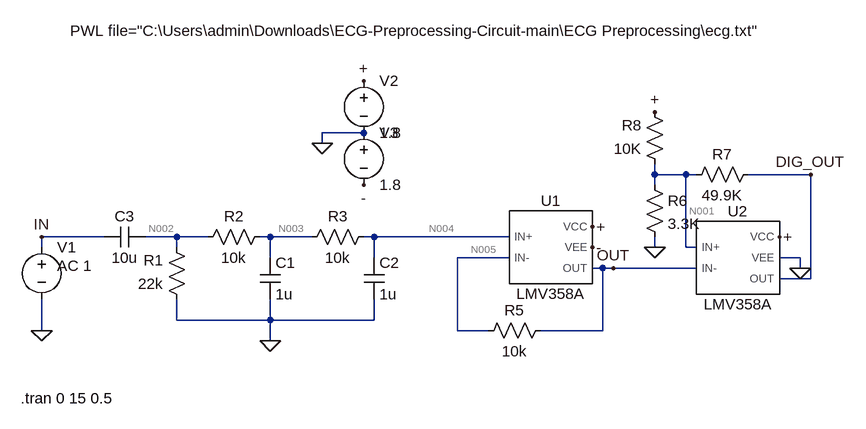
[diagram p0: schematic 心率检测_滞回比较.asc]
心率检测_滞回比较.asc, the LTspice schematic file:
Version 4.1
SHEET 1 1144 680
WIRE 384 -32 320 -32
WIRE 320 -16 320 -32
WIRE 832 32 832 16
WIRE 880 32 832 32
WIRE 896 32 880 32
WIRE 1072 32 976 32
WIRE 832 48 832 32
WIRE -16 128 -112 128
WIRE 96 128 48 128
WIRE 144 128 96 128
WIRE 240 128 224 128
WIRE 304 128 240 128
WIRE 400 128 384 128
WIRE 608 128 400 128
WIRE -112 144 -112 128
WIRE 96 144 96 128
WIRE 832 144 832 128
WIRE 880 144 880 32
WIRE 896 144 880 144
WIRE 240 160 240 128
WIRE 400 160 400 128
WIRE 608 160 528 160
WIRE 1056 160 1024 160
WIRE 752 176 736 176
WIRE 768 176 752 176
WIRE 896 176 768 176
WIRE 1056 176 1056 160
WIRE 1072 192 1072 32
WIRE 1072 192 1024 192
WIRE 96 256 96 224
WIRE 240 256 240 224
WIRE 240 256 96 256
WIRE 400 256 400 224
WIRE 400 256 240 256
WIRE -112 272 -112 224
WIRE 528 272 528 160
WIRE 576 272 528 272
WIRE 752 272 752 176
WIRE 752 272 656 272
WIRE 240 288 240 256
FLAG 240 288 0
FLAG -112 272 0
FLAG 320 -16 0
FLAG 384 48 -
FLAG 384 -112 +
FLAG 736 112 +
FLAG 1024 128 +
FLAG 736 144 -
FLAG 832 144 0
FLAG 832 -64 +
FLAG 1056 176 0
FLAG -112 128 IN
FLAG 768 176 OUT
FLAG 1072 32 DIG_OUT
DATAFLAG 832 32 ""
SYMBOL res 112 240 R180
WINDOW 0 36 76 Left 2
WINDOW 3 36 40 Left 2
SYMATTR InstName R1
SYMATTR Value 22k
SYMBOL res 128 144 R270
WINDOW 0 32 56 VTop 2
WINDOW 3 0 56 VBottom 2
SYMATTR InstName R2
SYMATTR Value 10k
SYMBOL res 288 144 R270
WINDOW 0 32 56 VTop 2
WINDOW 3 0 56 VBottom 2
SYMATTR InstName R3
SYMATTR Value 10k
SYMBOL cap 224 160 R0
SYMATTR InstName C1
SYMATTR Value 1u
SYMBOL cap 384 160 R0
SYMATTR InstName C2
SYMATTR Value 1u
SYMBOL cap 48 112 R90
WINDOW 0 0 32 VBottom 2
WINDOW 3 32 32 VTop 2
SYMATTR InstName C3
SYMATTR Value 10u
SYMBOL voltage -112 128 R0
WINDOW 3 44 -317 Left 2
WINDOW 123 24 44 Left 2
WINDOW 39 0 0 Left 0
SYMATTR Value PWL file="C:\Users\admin\Downloads\ECG-Preprocessing-Circuit-main\ECG Preprocessing\ecg.txt"
SYMATTR Value2 AC 1
SYMATTR InstName V1
SYMBOL LMV358A 672 144 R0
SYMATTR InstName U1
SYMBOL LMV358A 960 160 R0
SYMATTR InstName U2
SYMBOL res 672 256 R90
WINDOW 0 0 56 VBottom 2
WINDOW 3 32 56 VTop 2
SYMATTR InstName R5
SYMATTR Value 10k
SYMBOL res 816 32 R0
SYMATTR InstName R6
SYMATTR Value 3.3K
SYMBOL res 992 16 R90
WINDOW 0 0 56 VBottom 2
WINDOW 3 32 56 VTop 2
SYMATTR InstName R7
SYMATTR Value 49.9K
SYMBOL res 848 32 R180
WINDOW 0 36 76 Left 2
WINDOW 3 36 40 Left 2
SYMATTR InstName R8
SYMATTR Value 10K
SYMBOL voltage 384 -128 R0
WINDOW 123 0 0 Left 0
WINDOW 39 0 0 Left 0
SYMATTR InstName V2
SYMATTR Value 1.8
SYMBOL voltage 384 -48 R0
WINDOW 123 0 0 Left 0
WINDOW 39 0 0 Left 0
SYMATTR InstName V3
SYMATTR Value 1.8
TEXT -144 376 Left 2 !.tran 0 15 0.5

The netlist it stands for:
* 心率检测_滞回比较.asc
R1 0 N002 22k
R2 N002 N003 10k
R3 N003 N004 10k
C1 N003 0 1u
C2 N004 0 1u
C3 N002 IN 10u
V1 IN 0 PWL file="C:\Users\admin\Downloads\ECG-Preprocessing-Circuit-main\ECG Preprocessing\ecg.txt" AC 1
X§U1 N004 N005 + - OUT LMV358A  ; pins IN+ IN- VCC VEE OUT
X§U2 N001 OUT + 0 DIG_OUT LMV358A  ; pins IN+ IN- VCC VEE OUT
R5 OUT N005 10k
R6 N001 0 3.3K
R7 DIG_OUT N001 49.9K
R8 N001 + 10K
V2 + 0 1.8
V3 0 - 1.8
.tran 0 15 0.5
.lib lmv358a.lib
.backanno
.end

* Results of the author's LTspice run, read from the files saved beside the schematic
* Operating Point, zero values left out:
*   V(+) = 1.8 V
*   V(-) = -1.8 V
*   V(dig_out) = 1.791 V
*   V(in) = -5.12 V
*   V(n001) = 510.3 mV
*   V(n002) = -220 nV
*   V(n003) = -320 nV
*   V(n004) = -420 nV
*   V(n005) = 998.1 µV
*   V(out) = 998.2 µV
*   I(R1) = 10 pA
*   I(R2) = 10 pA
*   I(R3) = 10 pA
*   I(R5) = 7.005 pA
*   I(R6) = 154.6 µA
*   I(R7) = 25.66 µA
*   I(R8) = -129 µA
*   I(V2) = -314.6 µA
*   I(V3) = -80 µA
*   Ix(u1:in+) = 10 pA
*   Ix(u1:in-) = 7.005 pA
*   Ix(u1:out) = -9.51 pA
*   Ix(u1:vcc) = 80 µA
*   Ix(u1:vee) = -80 µA
*   Ix(u2:in+) = 8.082 pA
*   Ix(u2:in-) = 2.505 pA
*   Ix(u2:out) = -25.66 µA
*   Ix(u2:vcc) = 105.7 µA
*   Ix(u2:vee) = -80 µA
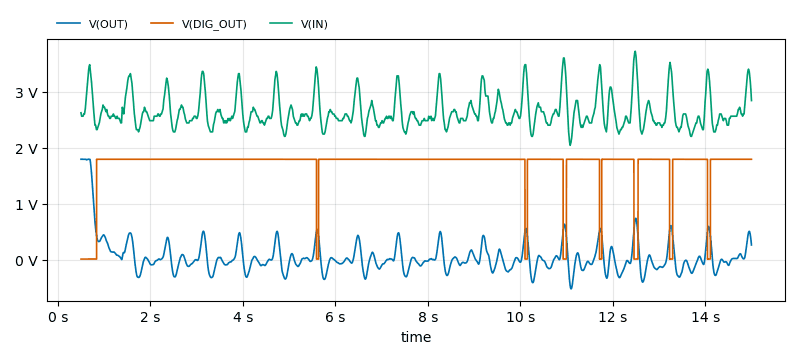
[diagram p1: Transient Analysis of 心率检测_滞回比较.asc, plotted from the saved traces]
* Transient Analysis, 1 run:
*   V(OUT): min -522.7 mV, max 1.791 V, average 49.49 mV, rms 319.2 mV, last 260.6 mV
*   V(DIG_OUT): min 8.692 mV, max 1.791 V, average 1.696 V, rms 1.743 V, last 1.791 V
*   V(IN): min 2.04 V, max 3.72 V, average 2.639 V, rms 2.655 V, last 2.84 V